# EAGLE schematic EEZ DIB MCU r1B5 (EAGLE 7.2.0)
Assembly variants: Farnell, TME

## Sheet 1 of 5: I/O connectors, Encoder, user SW
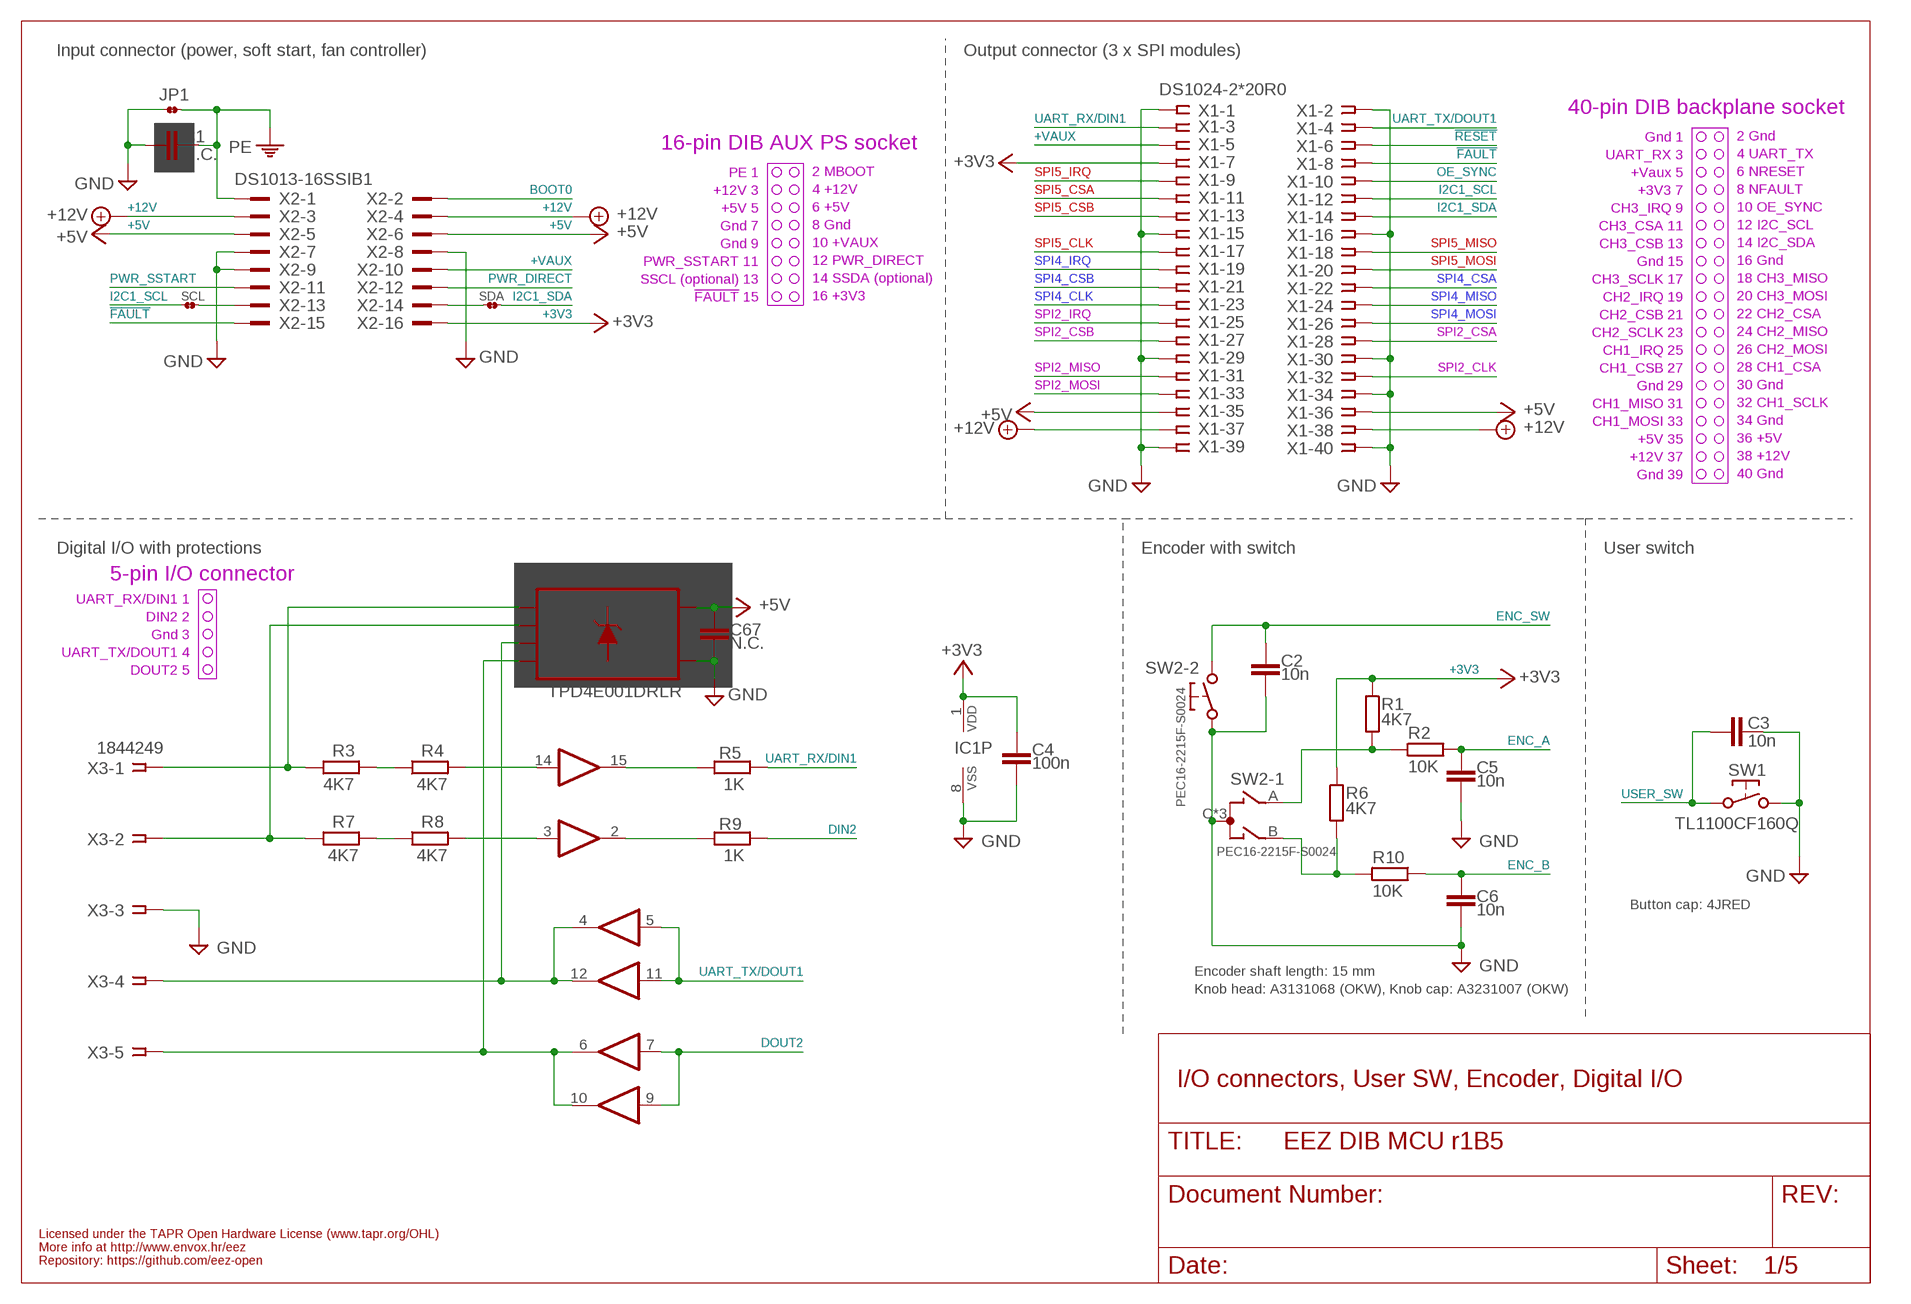
[diagram p0: schematic, sheet 1]

### Parts
C1  N.C.  C-EUC0805  [C0805]
C2  10n  C-EUC0805  [C0805]
C3  10n  C-EUC0805  [C0805]
C4  100n  C-EUC0603  [C0603]
C5  10n  C-EUC0805  [C0805]
C6  10n  C-EUC0805  [C0805]
C67  N.C.  C-EUC0603  [C0603]
IC1  CD74HC4050PWR  [PW16]
IC14  TPD4E001DRLR  TPD4E001-DRL  [DRL6]
JP1  JP2-NOCUT  [JP2-NOCUT]
R1  4K7  R-EU_R0805  [R0805]
R2  10K  R-EU_R0805  [R0805]
R3  4K7  R-EU_R0805  [R0805]
R4  4K7  R-EU_R0805  [R0805]
R5  1K  R-EU_R0805  [R0805]
R6  4K7  R-EU_R0805  [R0805]
R7  4K7  R-EU_R0805  [R0805]
R8  4K7  R-EU_R0805  [R0805]
R9  1K  R-EU_R0805  [R0805]
R10  10K  R-EU_R0805  [R0805]
SCL  JP2-NOCUT  [JP2-NOCUT]
SDA  JP2-NOCUT  [JP2-NOCUT]
SW1  TL1100CF160Q  TL1100C  [TL1100C]
SW2  PEC16-2215F-S0024  ENCODER_SW-PEC16  [PEC16-2215F]
X1  DS1024-2*20R0  ZL263-40DG  [ZL263-40DG]
X2  DS1013-16SSIB1  IDC-16PIN  [IDC-16PIN]
X3  1844249  MC1,5/5-G-3,5  [MC1,5/5-G-3,5]

### Nets
!FAULT: X1.8 X2.15 ; also sheet 2
!RESET: X1.6 ; also sheet 2,3,4,5
+3V3: C4.1 IC1.1(P:VDD) R1.1 R6.1 X1.7 X2.16 ; also sheet 2,3,4,5
+5V: C67.1 IC14.6(VCC) X1.35 X1.36 X2.5 X2.6 ; also sheet 2,4
+12V: X1.37 X1.38 X2.3 X2.4
+VAUX: X1.5 X2.10 ; also sheet 2
BOOT0: X2.2 ; also sheet 2
DIN2: R9.2 ; also sheet 2
DOUT2: IC1.7(C:I) IC1.9(D:I) ; also sheet 2
ENC_A: C5.2 R2.1 ; also sheet 2
ENC_B: C6.1 R10.1 ; also sheet 2
ENC_SW: C2.2 SW2.E ; also sheet 2
EOUT_A: R6.2 R10.2 SW2.B(-1:B)
EOUT_B: R1.2 R2.2 SW2.A(-1:A)
GND [gnd]: C1.2 C2.1 C3.1 C4.2 C5.1 C6.2 C67.2 IC1.8(P:VSS) IC14.3(GND) JP1.1 SW1.2 SW2.C(-1:C) SW2.D SW2.GND1(-1:C) SW2.GND2(-1:C) X1.1 X1.2 X1.15 X1.16 X1.29 X1.30 X1.34 X1.39 X1.40 X2.7 X2.8 X2.9 X3.3 ; also sheet 2,3,4,5
I2C1_SCL: SCL.1 X1.12 ; also sheet 2,3,4
I2C1_SDA: SDA.2 X1.14 ; also sheet 2,3,4
N$6: IC14.1(IO1) R3.1 X3.1
N$7: SCL.2 X2.13
N$13: SDA.1 X2.14
N$14: IC14.2(IO2) R7.1 X3.2
N$38: R7.2 R8.1
N$41: R3.2 R4.1
N$42: IC1.15(F:O) R5.1
N$43: IC1.2(A:O) R9.1
N$46: IC1.14(F:I) R4.2
N$47: IC1.3(A:I) R8.2
N$48: IC1.4(B:O) IC1.12(E:O) IC14.4(IO3) X3.4
N$49: IC1.6(C:O) IC1.10(D:O) IC14.5(IO4) X3.5
OE_SYNC: X1.10 ; also sheet 2
PE: C1.1 JP1.2 X2.1 ; also sheet 4,5
PWR_DIRECT: X2.12 ; also sheet 2
PWR_SSTART: X2.11 ; also sheet 2
SPI2_CLK: X1.32 ; also sheet 2
SPI2_CSA: X1.28 ; also sheet 2
SPI2_CSB: X1.27 ; also sheet 2
SPI2_IRQ: X1.25 ; also sheet 2
SPI2_MISO: X1.31 ; also sheet 2
SPI2_MOSI: X1.33 ; also sheet 2
SPI4_CLK: X1.23 ; also sheet 2
SPI4_CSA: X1.22 ; also sheet 2
SPI4_CSB: X1.21 ; also sheet 2
SPI4_IRQ: X1.19 ; also sheet 2
SPI4_MISO: X1.24 ; also sheet 2
SPI4_MOSI: X1.26 ; also sheet 2
SPI5_CLK: X1.17 ; also sheet 2
SPI5_CSA: X1.11 ; also sheet 2
SPI5_CSB: X1.13 ; also sheet 2
SPI5_IRQ: X1.9 ; also sheet 2
SPI5_MISO: X1.18 ; also sheet 2
SPI5_MOSI: X1.20 ; also sheet 2
UART_RX/DIN1: R5.2 X1.3 ; also sheet 2
UART_TX/DOUT1: IC1.5(B:I) IC1.11(E:I) X1.4 ; also sheet 2
USER_SW: C3.2 SW1.1 ; also sheet 2

### Notes on the sheet
- Input connector (power, soft start, fan controller) | Output connector (3 x SPI modules)
- 40-pin DIB backplane socket
- Gnd 1
- 2 Gnd
- 16-pin DIB AUX PS socket | UART_RX 3
- 4 UART_TX
- PE 1 | +Vaux 5
- 2 MBOOT | 6 NRESET
- +12V 3 | +3V3 7
- 4 +12V | 8 NFAULT
- +5V 5 | CH3_IRQ 9
- 6 +5V | 10 OE_SYNC
- Gnd 7 | CH3_CSA 11
- 8 Gnd | 12 I2C_SCL
- Gnd 9 | CH3_CSB 13
- 10 +VAUX | 14 I2C_SDA
- PWR_SSTART 11 | Gnd 15
- 12 PWR_DIRECT | 16 Gnd
- SSCL (optional) 13 | CH3_SCLK 17
- 14 SSDA (optional) | 18 CH3_MISO
- !FAULT! 15 | CH2_IRQ 19
- 16 +3V3 | 20 CH3_MOSI
- CH2_CSB 21
- 22 CH2_CSA
- CH2_SCLK 23
- 24 CH2_MISO
- CH1_IRQ 25
- 26 CH2_MOSI
- CH1_CSB 27
- 28 CH1_CSA
- Gnd 29
- 30 Gnd
- CH1_MISO 31
- 32 CH1_SCLK
- CH1_MOSI 33
- 34 Gnd
- +5V 35
- 36 +5V
- +12V 37
- 38 +12V
- Gnd 39
- 40 Gnd
- Digital I/O with protections | Encoder with switch | User switch
- 5-pin I/O connector
- UART_RX/DIN1 1
- DIN2 2
- Gnd 3
- UART_TX/DOUT1 4
- DOUT2 5
- Button cap: 4JRED
- Encoder shaft length: 15 mm
- Knob head: A3131068 (OKW), Knob cap: A3231007 (OKW)
- I/O connectors, User SW, Encoder, Digital I/O
- Licensed under the TAPR Open Hardware License (www.tapr.org/OHL)
- More info at http://www.envox.hr/eez
- Repository: https://github.com/eez-open

## Sheet 2 of 5: STM32F7 MCU
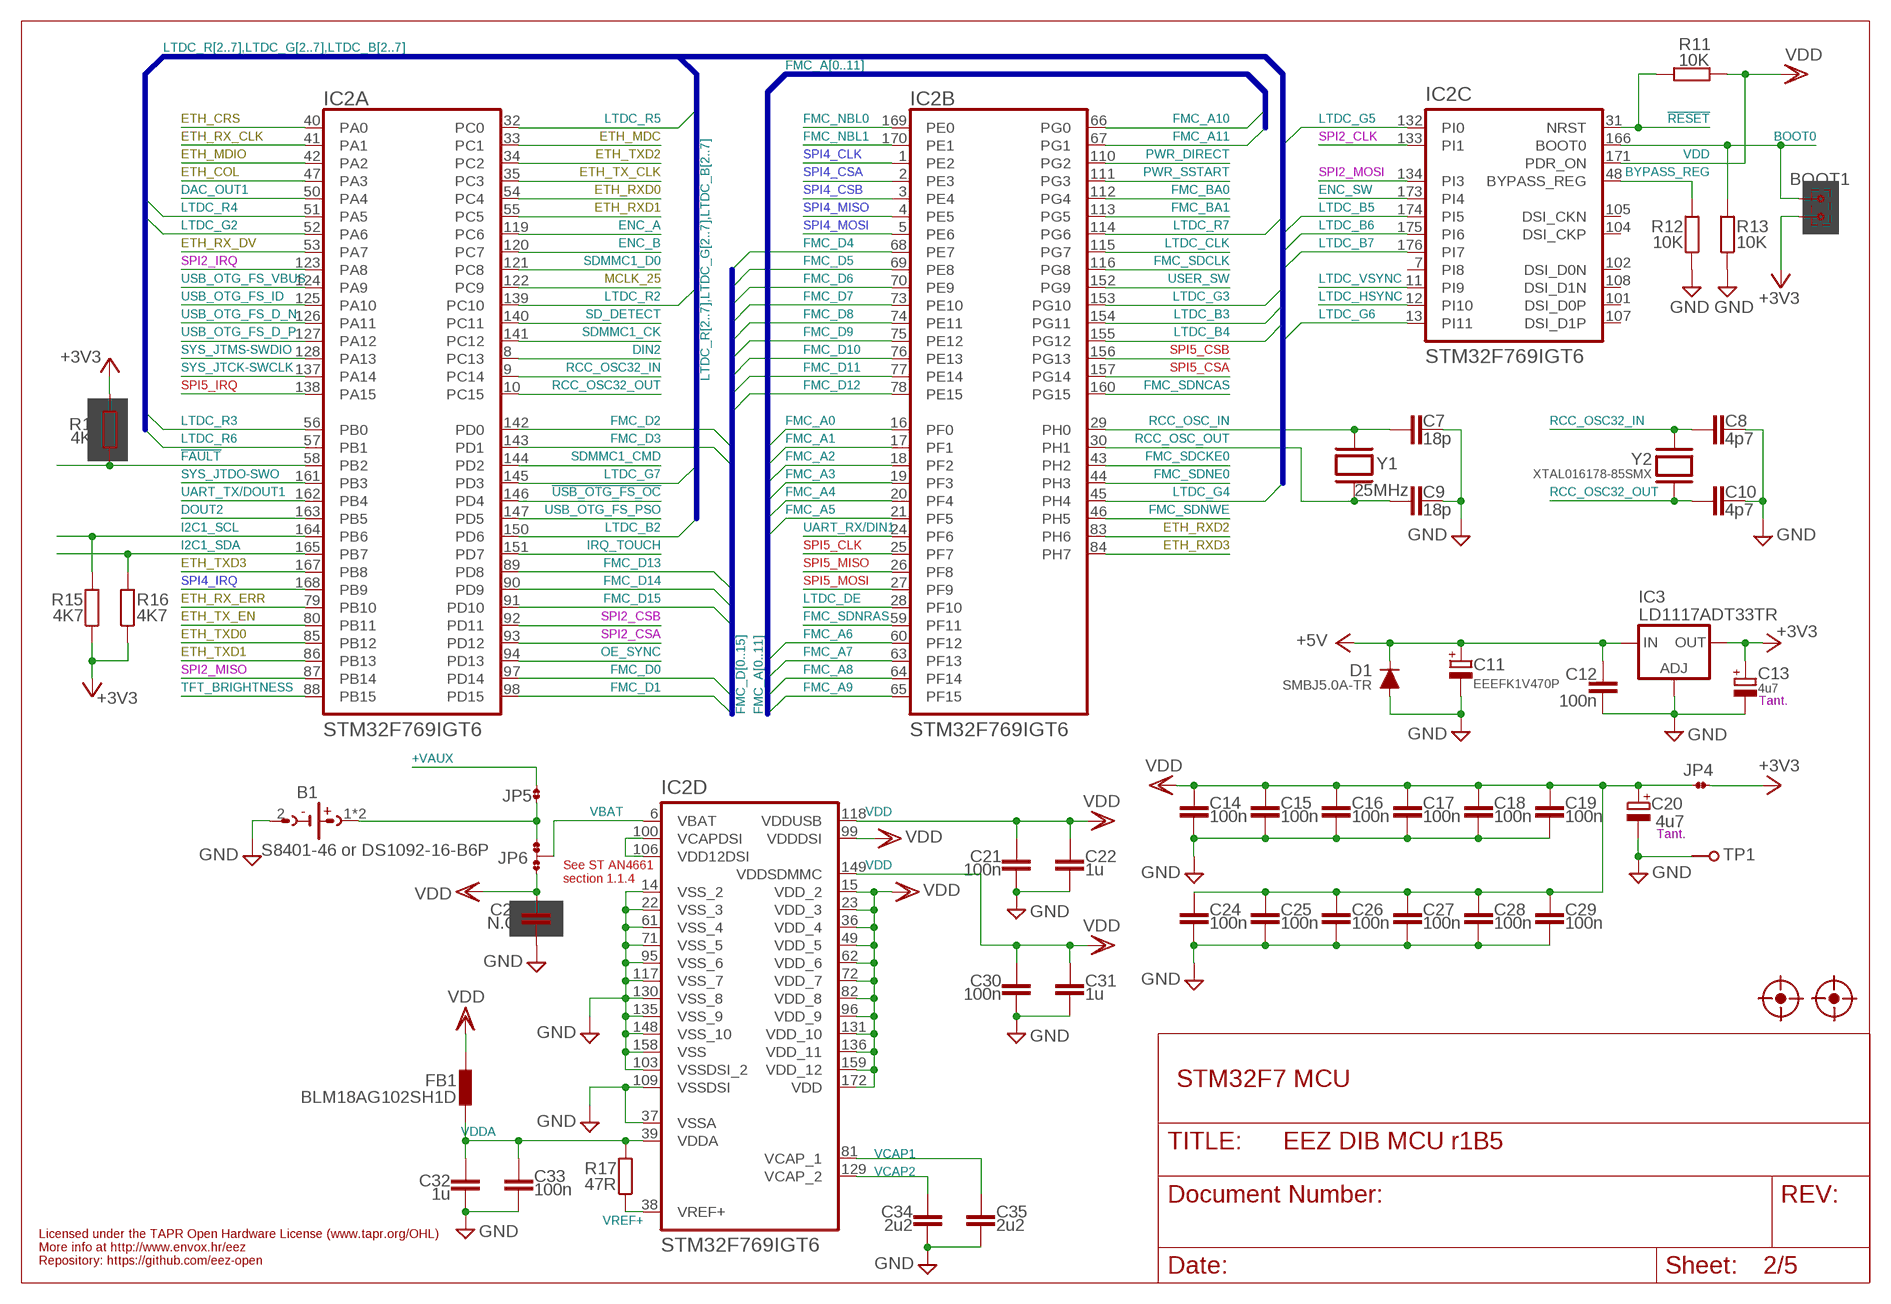
[diagram p1: schematic, sheet 2]

### Parts
B1  S8401-46 or DS1092-16-B6P  CELL_BATTERYVERT  [S8401-46]
BOOT1  JUMPER-2PIN-2MM  [2MM-2]
C7  18p  C-EUC0603  [C0603]
C8  4p7  C-EUC0603  [C0603]
C9  18p  C-EUC0603  [C0603]
C10  4p7  C-EUC0603  [C0603]
C11  EEEFK1V470P  ECAPPANASONIC_H  [CAPAE660X610N]
C12  100n  C-EUC0603  [C0603]
C13  4u7  ECAP1206  [EC1206]
C14  100n  C-EUC0603  [C0603]
C15  100n  C-EUC0603  [C0603]
C16  100n  C-EUC0603  [C0603]
C17  100n  C-EUC0603  [C0603]
C18  100n  C-EUC0603  [C0603]
C19  100n  C-EUC0603  [C0603]
C20  4u7  ECAP1206  [EC1206]
C21  100n  C-EUC0603  [C0603]
C22  1u  C-EUC0805  [C0805]
C23  N.C.  C-EUC0603  [C0603]
C24  100n  C-EUC0603  [C0603]
C25  100n  C-EUC0603  [C0603]
C26  100n  C-EUC0603  [C0603]
C27  100n  C-EUC0603  [C0603]
C28  100n  C-EUC0603  [C0603]
C29  100n  C-EUC0603  [C0603]
C30  100n  C-EUC0603  [C0603]
C31  1u  C-EUC0805  [C0805]
C32  1u  C-EUC0805  [C0805]
C33  100n  C-EUC0603  [C0603]
C34  2u2  C-EUC0805  [C0805]
C35  2u2  C-EUC0805  [C0805]
D1  SMBJ5.0A-TR  DIODEDO214AA  [DO214AA]
FB1  BLM18AG102SH1D  FERRITE_BEAD0603  [BEAD0603]
FM1  FIDUCIAL  [FIDUCIAL]
FM2  FIDUCIAL  [FIDUCIAL]
IC2  STM32F769IGT6  STM32F769IXT  [LQFP-176_24X24MM]
IC3  LD1117ADT33TR  LD117ADT33TR  [DPACK]
JP4  JP2-NOCUT  [JP2-NOCUT]
JP5  JP2-CUT  [JP2-CUT]
JP6  JP3-CUT  [JP3-CUT]
R11  10K  R-EU_R0805  [R0805]
R12  10K  R-EU_R0805  [R0805]
R13  10K  R-EU_R0805  [R0805]
R14  4K7  R-EU_R0805  [R0805]
R15  4K7  R-EU_R0805  [R0805]
R16  4K7  R-EU_R0805  [R0805]
R17  47R  R-EU_R0805  [R0805]
TP1  PCB_TEST_TABSHIELD  [PCB_SHIELD_TAB]
Y1  25MHz  XTALSMD  [HC-49/4H]
Y2  XTAL016178-85SMX  XTAL85SMX  [85SMX]

### Nets
!FAULT: IC2.58(A:PB2) R14.2 ; also sheet 1
!RESET: IC2.31(C:NRST) R11.2 ; also sheet 1,3,4,5
!USB_OTG_FS_OC: IC2.146(A:PD4) ; also sheet 4
+3V3: BOOT1.2 C13.+ IC3.4(OUT) JP4.2 R14.1 R15.1 R16.1 ; also sheet 1,3,4,5
+5V: C11.1(+) C12.1 D1.C IC3.3(IN) ; also sheet 1,4
+VAUX: JP5.2 ; also sheet 1
BOOT0: BOOT1.1 IC2.166(C:BOOT0) R13.2 ; also sheet 1
BYPASS_REG: IC2.48(C:BYPASS_REG) R12.2
DAC_OUT1: IC2.50(A:PA4) ; also sheet 4
DIN2: IC2.8(A:PC13) ; also sheet 1
DOUT2: IC2.163(A:PB5) ; also sheet 1
ENC_A: IC2.119(A:PC6) ; also sheet 1
ENC_B: IC2.120(A:PC7) ; also sheet 1
ENC_SW: IC2.173(C:PI4) ; also sheet 1
ETH_COL: IC2.47(A:PA3) ; also sheet 5
ETH_CRS: IC2.40(A:PA0) ; also sheet 5
ETH_MDC: IC2.33(A:PC1) ; also sheet 5
ETH_MDIO: IC2.42(A:PA2) ; also sheet 5
ETH_RX_CLK: IC2.41(A:PA1) ; also sheet 5
ETH_RX_DV: IC2.53(A:PA7) ; also sheet 5
ETH_RX_ERR: IC2.79(A:PB10) ; also sheet 5
ETH_RXD0: IC2.54(A:PC4) ; also sheet 5
ETH_RXD1: IC2.55(A:PC5) ; also sheet 5
ETH_RXD2: IC2.83(B:PH6) ; also sheet 5
ETH_RXD3: IC2.84(B:PH7) ; also sheet 5
ETH_TX_CLK: IC2.35(A:PC3) ; also sheet 5
ETH_TX_EN: IC2.80(A:PB11) ; also sheet 5
ETH_TXD0: IC2.85(A:PB12) ; also sheet 5
ETH_TXD1: IC2.86(A:PB13) ; also sheet 5
ETH_TXD2: IC2.34(A:PC2) ; also sheet 5
ETH_TXD3: IC2.167(A:PB8) ; also sheet 5
FMC_A0: IC2.16(B:PF0) ; also sheet 3
FMC_A1: IC2.17(B:PF1) ; also sheet 3
FMC_A2: IC2.18(B:PF2) ; also sheet 3
FMC_A3: IC2.19(B:PF3) ; also sheet 3
FMC_A4: IC2.20(B:PF4) ; also sheet 3
FMC_A5: IC2.21(B:PF5) ; also sheet 3
FMC_A6: IC2.60(B:PF12) ; also sheet 3
FMC_A7: IC2.63(B:PF13) ; also sheet 3
FMC_A8: IC2.64(B:PF14) ; also sheet 3
FMC_A9: IC2.65(B:PF15) ; also sheet 3
FMC_A10: IC2.66(B:PG0) ; also sheet 3
FMC_A11: IC2.67(B:PG1) ; also sheet 3
FMC_BA0: IC2.112(B:PG4) ; also sheet 3
FMC_BA1: IC2.113(B:PG5) ; also sheet 3
FMC_D0: IC2.97(A:PD14) ; also sheet 3
FMC_D1: IC2.98(A:PD15) ; also sheet 3
FMC_D2: IC2.142(A:PD0) ; also sheet 3
FMC_D3: IC2.143(A:PD1) ; also sheet 3
FMC_D4: IC2.68(B:PE7) ; also sheet 3
FMC_D5: IC2.69(B:PE8) ; also sheet 3
FMC_D6: IC2.70(B:PE9) ; also sheet 3
FMC_D7: IC2.73(B:PE10) ; also sheet 3
FMC_D8: IC2.74(B:PE11) ; also sheet 3
FMC_D9: IC2.75(B:PE12) ; also sheet 3
FMC_D10: IC2.76(B:PE13) ; also sheet 3
FMC_D11: IC2.77(B:PE14) ; also sheet 3
FMC_D12: IC2.78(B:PE15) ; also sheet 3
FMC_D13: IC2.89(A:PD8) ; also sheet 3
FMC_D14: IC2.90(A:PD9) ; also sheet 3
FMC_D15: IC2.91(A:PD10) ; also sheet 3
FMC_NBL0: IC2.169(B:PE0) ; also sheet 3
FMC_NBL1: IC2.170(B:PE1) ; also sheet 3
FMC_SDCKE0: IC2.43(B:PH2) ; also sheet 3
FMC_SDCLK: IC2.116(B:PG8) ; also sheet 3
FMC_SDNCAS: IC2.160(B:PG15) ; also sheet 3
FMC_SDNE0: IC2.44(B:PH3) ; also sheet 3
FMC_SDNRAS: IC2.59(B:PF11) ; also sheet 3
FMC_SDNWE: IC2.46(B:PH5) ; also sheet 3
GND [gnd]: B1.2(-) C7.1 C8.2 C9.1 C10.2 C11.2(-) C12.2 C13.- C14.2 C15.2 C16.2 C17.2 C18.2 C19.2 C20.- C21.2 C22.2 C23.2 C24.2 C25.2 C26.2 C27.2 C28.2 C29.2 C30.2 C31.2 C32.2 C33.2 C34.2 C35.2 D1.A IC2.14(D:VSS_2) IC2.22(D:VSS_3) IC2.37(D:VSSA) IC2.61(D:VSS_4) IC2.71(D:VSS_5) IC2.95(D:VSS_6) IC2.103(D:VSSDSI_2) IC2.109(D:VSSDSI) IC2.117(D:VSS_7) IC2.130(D:VSS_8) IC2.135(D:VSS_9) IC2.148(D:VSS_10) IC2.158(D:VSS) IC3.1(ADJ) R12.1 R13.1 TP1.1 ; also sheet 1,3,4,5
I2C1_SCL: IC2.164(A:PB6) R15.2 ; also sheet 1,3,4
I2C1_SDA: IC2.165(A:PB7) R16.2 ; also sheet 1,3,4
IRQ_TOUCH: IC2.151(A:PD7) ; also sheet 4
LTDC_B2: IC2.150(A:PD6) ; also sheet 4
LTDC_B3: IC2.154(B:PG11) ; also sheet 4
LTDC_B4: IC2.155(B:PG12) ; also sheet 4
LTDC_B5: IC2.174(C:PI5) ; also sheet 4
LTDC_B6: IC2.175(C:PI6) ; also sheet 4
LTDC_B7: IC2.176(C:PI7) ; also sheet 4
LTDC_CLK: IC2.115(B:PG7) ; also sheet 4
LTDC_DE: IC2.28(B:PF10) ; also sheet 4
LTDC_G2: IC2.52(A:PA6) ; also sheet 4
LTDC_G3: IC2.153(B:PG10) ; also sheet 4
LTDC_G4: IC2.45(B:PH4) ; also sheet 4
LTDC_G5: IC2.132(C:PI0) ; also sheet 4
LTDC_G6: IC2.13(C:PI11) ; also sheet 4
LTDC_G7: IC2.145(A:PD3) ; also sheet 4
LTDC_HSYNC: IC2.12(C:PI10) ; also sheet 4
LTDC_R2: IC2.139(A:PC10) ; also sheet 4
LTDC_R3: IC2.56(A:PB0) ; also sheet 4
LTDC_R4: IC2.51(A:PA5) ; also sheet 4
LTDC_R5: IC2.32(A:PC0) ; also sheet 4
LTDC_R6: IC2.57(A:PB1) ; also sheet 4
LTDC_R7: IC2.114(B:PG6) ; also sheet 4
LTDC_VSYNC: IC2.11(C:PI9) ; also sheet 4
MCLK_25: IC2.122(A:PC9) ; also sheet 5
N$20: B1.1(+) B1.3(+) JP5.1 JP6.NC
N$178: IC2.100(D:VCAPDSI) IC2.106(D:VDD12DSI)
OE_SYNC: IC2.94(A:PD13) ; also sheet 1
PWR_DIRECT: IC2.110(B:PG2) ; also sheet 1
PWR_SSTART: IC2.111(B:PG3) ; also sheet 1
RCC_OSC32_IN: C8.1 IC2.9(A:PC14) Y2.1
RCC_OSC32_OUT: C10.1 IC2.10(A:PC15) Y2.4
RCC_OSC_IN: C7.2 IC2.29(B:PH0) Y1.2
RCC_OSC_OUT: C9.2 IC2.30(B:PH1) Y1.1
SD_DETECT: IC2.140(A:PC11) ; also sheet 3
SDMMC1_CK: IC2.141(A:PC12) ; also sheet 3
SDMMC1_CMD: IC2.144(A:PD2) ; also sheet 3
SDMMC1_D0: IC2.121(A:PC8) ; also sheet 3
SPI2_CLK: IC2.133(C:PI1) ; also sheet 1
SPI2_CSA: IC2.93(A:PD12) ; also sheet 1
SPI2_CSB: IC2.92(A:PD11) ; also sheet 1
SPI2_IRQ: IC2.123(A:PA8) ; also sheet 1
SPI2_MISO: IC2.87(A:PB14) ; also sheet 1
SPI2_MOSI: IC2.134(C:PI3) ; also sheet 1
SPI4_CLK: IC2.1(B:PE2) ; also sheet 1
SPI4_CSA: IC2.2(B:PE3) ; also sheet 1
SPI4_CSB: IC2.3(B:PE4) ; also sheet 1
SPI4_IRQ: IC2.168(A:PB9) ; also sheet 1
SPI4_MISO: IC2.4(B:PE5) ; also sheet 1
SPI4_MOSI: IC2.5(B:PE6) ; also sheet 1
SPI5_CLK: IC2.25(B:PF7) ; also sheet 1
SPI5_CSA: IC2.157(B:PG14) ; also sheet 1
SPI5_CSB: IC2.156(B:PG13) ; also sheet 1
SPI5_IRQ: IC2.138(A:PA15) ; also sheet 1
SPI5_MISO: IC2.26(B:PF8) ; also sheet 1
SPI5_MOSI: IC2.27(B:PF9) ; also sheet 1
SYS_JTCK-SWCLK: IC2.137(A:PA14) ; also sheet 3
SYS_JTDO-SWO: IC2.161(A:PB3) ; also sheet 3
SYS_JTMS-SWDIO: IC2.128(A:PA13) ; also sheet 3
TFT_BRIGHTNESS: IC2.88(A:PB15) ; also sheet 4
UART_RX/DIN1: IC2.24(B:PF6) ; also sheet 1
UART_TX/DOUT1: IC2.162(A:PB4) ; also sheet 1
USB_OTG_FS_D_N [diff]: IC2.126(A:PA11) ; also sheet 4
USB_OTG_FS_D_P [diff]: IC2.127(A:PA12) ; also sheet 4
USB_OTG_FS_ID: IC2.125(A:PA10) ; also sheet 4
USB_OTG_FS_PSO: IC2.147(A:PD5) ; also sheet 4
USB_OTG_FS_VBUS: IC2.124(A:PA9) ; also sheet 4
USER_SW: IC2.152(B:PG9) ; also sheet 1
VBAT: IC2.6(D:VBAT) JP6.COM
VCAP1: C35.1 IC2.81(D:VCAP_1)
VCAP2: C34.1 IC2.129(D:VCAP_2)
VDD: C14.1 C15.1 C16.1 C17.1 C18.1 C19.1 C20.+ C21.1 C22.1 C23.1 C24.1 C25.1 C26.1 C27.1 C28.1 C29.1 C30.1 C31.1 FB1.P$1 IC2.15(D:VDD_2) IC2.23(D:VDD_3) IC2.36(D:VDD_4) IC2.49(D:VDD_5) IC2.62(D:VDD_6) IC2.72(D:VDD_7) IC2.82(D:VDD_8) IC2.96(D:VDD_9) IC2.99(D:VDDDSI) IC2.118(D:VDDUSB) IC2.131(D:VDD_10) IC2.136(D:VDD_11) IC2.149(D:VDDSDMMC) IC2.159(D:VDD_12) IC2.171(C:PDR_ON) IC2.172(D:VDD) JP4.1 JP6.NO R11.1
VDDA: C32.1 C33.1 FB1.P$2 IC2.39(D:VDDA) R17.2
VREF+: IC2.38(D:VREF+) R17.1
Unconnected: IC2.7(C:PI8) IC2.101(C:DSI_D0P) IC2.102(C:DSI_D0N) IC2.104(C:DSI_CKP) IC2.105(C:DSI_CKN) IC2.107(C:DSI_D1P) IC2.108(C:DSI_D1N)

### Buses
FMC_A[0..11]
LTDC_R[2..7],LTDC_G[2..7],LTDC_B[2..7]
FMC_D[0..15]

### Notes on the sheet
- Tant.
- Tant.
- See ST AN4661
  section 1.1.4
- STM32F7 MCU
- Licensed under the TAPR Open Hardware License (www.tapr.org/OHL)
- More info at http://www.envox.hr/eez
- Repository: https://github.com/eez-open

## Sheet 3 of 5: SDRAM, JTAG, SD card, EEPROM
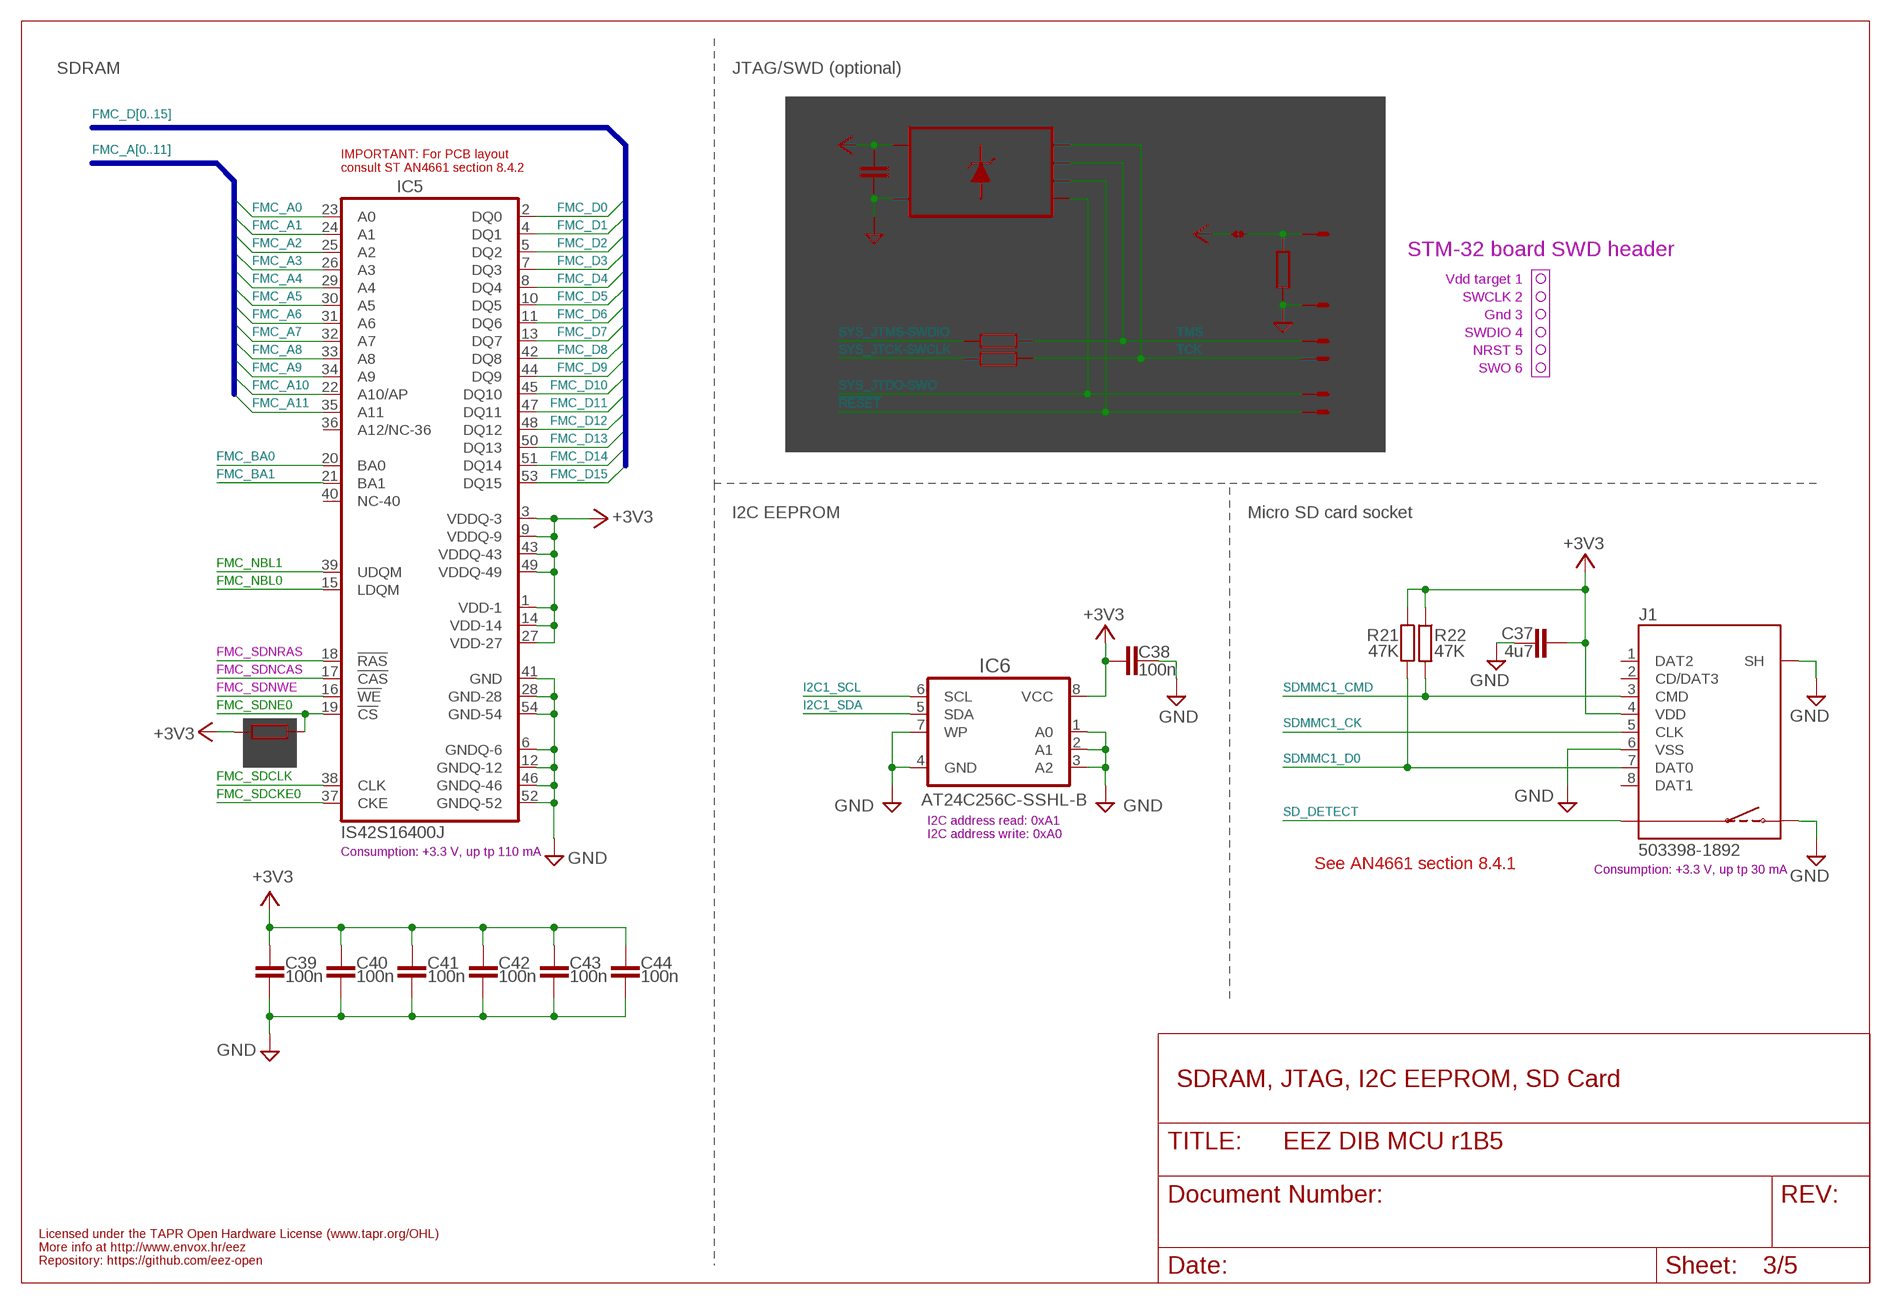
[diagram p2: schematic, sheet 3]

### Parts
C36  N.C.  C-EUC0603  [C0603]
C37  4u7  C-EUC1206  [C1206]
C38  100n  C-EUC0603  [C0603]
C39  100n  C-EUC0603  [C0603]
C40  100n  C-EUC0603  [C0603]
C41  100n  C-EUC0603  [C0603]
C42  100n  C-EUC0603  [C0603]
C43  100n  C-EUC0603  [C0603]
C44  100n  C-EUC0603  [C0603]
IC4  TPD4E001DRLR  TPD4E001-DRL  [DRL6]
IC5  IS42S16400J  IS42S16400  [TSOPII-54]
IC6  AT24C256C-SSHL-B  AT24CXXSOIC8  [SOIC127P600X173-8N]
J1  503398-1892  5033981892  [5033981892]
JP7  JP2-CUT  [JP2-CUT]
R18  N.C.  R-EU_R0805  [R0805]
R19  N.C.  R-EU_R0805  [R0805]
R20  N.C.  R-EU_R0805  [R0805]
R21  47K  R-EU_R0805  [R0805]
R22  47K  R-EU_R0805  [R0805]
R23  N.C.  R-EU_R0805  [R0805]
X4  N.C.  22-23-2061  [22-23-2061]

### Nets
!RESET: IC4.4(IO3) X4.5 ; also sheet 1,2,4,5
+3V3: C36.1 C37.1 C38.2 C39.1 C40.1 C41.1 C42.1 C43.1 C44.1 IC4.6(VCC) IC5.1(VDD-1) IC5.3(VDDQ-3) IC5.9(VDDQ-9) IC5.14(VDD-14) IC5.27(VDD-27) IC5.43(VDDQ-43) IC5.49(VDDQ-49) IC6.8(VCC) J1.4(VDD) JP7.1 R21.1 R22.1 R23.1 ; also sheet 1,2,4,5
FMC_A0: IC5.23(A0) ; also sheet 2
FMC_A1: IC5.24(A1) ; also sheet 2
FMC_A2: IC5.25(A2) ; also sheet 2
FMC_A3: IC5.26(A3) ; also sheet 2
FMC_A4: IC5.29(A4) ; also sheet 2
FMC_A5: IC5.30(A5) ; also sheet 2
FMC_A6: IC5.31(A6) ; also sheet 2
FMC_A7: IC5.32(A7) ; also sheet 2
FMC_A8: IC5.33(A8) ; also sheet 2
FMC_A9: IC5.34(A9) ; also sheet 2
FMC_A10: IC5.22(A10/AP) ; also sheet 2
FMC_A11: IC5.35(A11) ; also sheet 2
FMC_BA0: IC5.20(BA0) ; also sheet 2
FMC_BA1: IC5.21(BA1) ; also sheet 2
FMC_D0: IC5.2(DQ0) ; also sheet 2
FMC_D1: IC5.4(DQ1) ; also sheet 2
FMC_D2: IC5.5(DQ2) ; also sheet 2
FMC_D3: IC5.7(DQ3) ; also sheet 2
FMC_D4: IC5.8(DQ4) ; also sheet 2
FMC_D5: IC5.10(DQ5) ; also sheet 2
FMC_D6: IC5.11(DQ6) ; also sheet 2
FMC_D7: IC5.13(DQ7) ; also sheet 2
FMC_D8: IC5.42(DQ8) ; also sheet 2
FMC_D9: IC5.44(DQ9) ; also sheet 2
FMC_D10: IC5.45(DQ10) ; also sheet 2
FMC_D11: IC5.47(DQ11) ; also sheet 2
FMC_D12: IC5.48(DQ12) ; also sheet 2
FMC_D13: IC5.50(DQ13) ; also sheet 2
FMC_D14: IC5.51(DQ14) ; also sheet 2
FMC_D15: IC5.53(DQ15) ; also sheet 2
FMC_NBL0: IC5.15(LDQM) ; also sheet 2
FMC_NBL1: IC5.39(UDQM) ; also sheet 2
FMC_SDCKE0: IC5.37(CKE) ; also sheet 2
FMC_SDCLK: IC5.38(CLK) ; also sheet 2
FMC_SDNCAS: IC5.17(!CAS) ; also sheet 2
FMC_SDNE0: IC5.19(!CS) R23.2 ; also sheet 2
FMC_SDNRAS: IC5.18(!RAS) ; also sheet 2
FMC_SDNWE: IC5.16(!WE) ; also sheet 2
GND [gnd]: C36.2 C37.2 C38.1 C39.2 C40.2 C41.2 C42.2 C43.2 C44.2 IC4.3(GND) IC5.6(GNDQ-6) IC5.12(GNDQ-12) IC5.28(GND-28) IC5.41(GND) IC5.46(GNDQ-46) IC5.52(GNDQ-52) IC5.54(GND-54) IC6.1(A0) IC6.2(A1) IC6.3(A2) IC6.4(GND) IC6.7(WP) J1.6(VSS) J1.S1(SH) J1.S2(SH) J1.S(SH) J1.SW2 R18.1 X4.3 ; also sheet 1,2,4,5
I2C1_SCL: IC6.6(SCL) ; also sheet 1,2,4
I2C1_SDA: IC6.5(SDA) ; also sheet 1,2,4
N$51: JP7.2 R18.2 X4.1
SD_DETECT: J1.SW1 ; also sheet 2
SDMMC1_CK: J1.5(CLK) ; also sheet 2
SDMMC1_CMD: J1.3(CMD) R22.2 ; also sheet 2
SDMMC1_D0: J1.7(DAT0) R21.2 ; also sheet 2
SYS_JTCK-SWCLK: R20.1 ; also sheet 2
SYS_JTDO-SWO: IC4.5(IO4) X4.6 ; also sheet 2
SYS_JTMS-SWDIO: R19.1 ; also sheet 2
TCK: IC4.1(IO1) R20.2 X4.2
TMS: IC4.2(IO2) R19.2 X4.4
Unconnected: IC5.36(A12/NC-36) IC5.40(NC-40) J1.1(DAT2) J1.2(CD/DAT3) J1.8(DAT1)

### Buses
FMC_A[0..11]
FMC_D[0..15]

### Notes on the sheet
- SDRAM | JTAG/SWD (optional)
- IMPORTANT: For PCB layout 
  consult ST AN4661 section 8.4.2
- STM-32 board SWD header
- Vdd target 1
- SWCLK 2
- Gnd 3
- SWDIO 4
- NRST 5
- SWO 6
- I2C EEPROM | Micro SD card socket
- I2C address read: 0xA1
- I2C address write: 0xA0
- Consumption: +3.3 V, up tp 110 mA
- See AN4661 section 8.4.1
- Consumption: +3.3 V, up tp 30 mA
- SDRAM, JTAG, I2C EEPROM, SD Card
- Licensed under the TAPR Open Hardware License (www.tapr.org/OHL)
- More info at http://www.envox.hr/eez
- Repository: https://github.com/eez-open

## Sheet 4 of 5: TFT LCD, Audio, USB
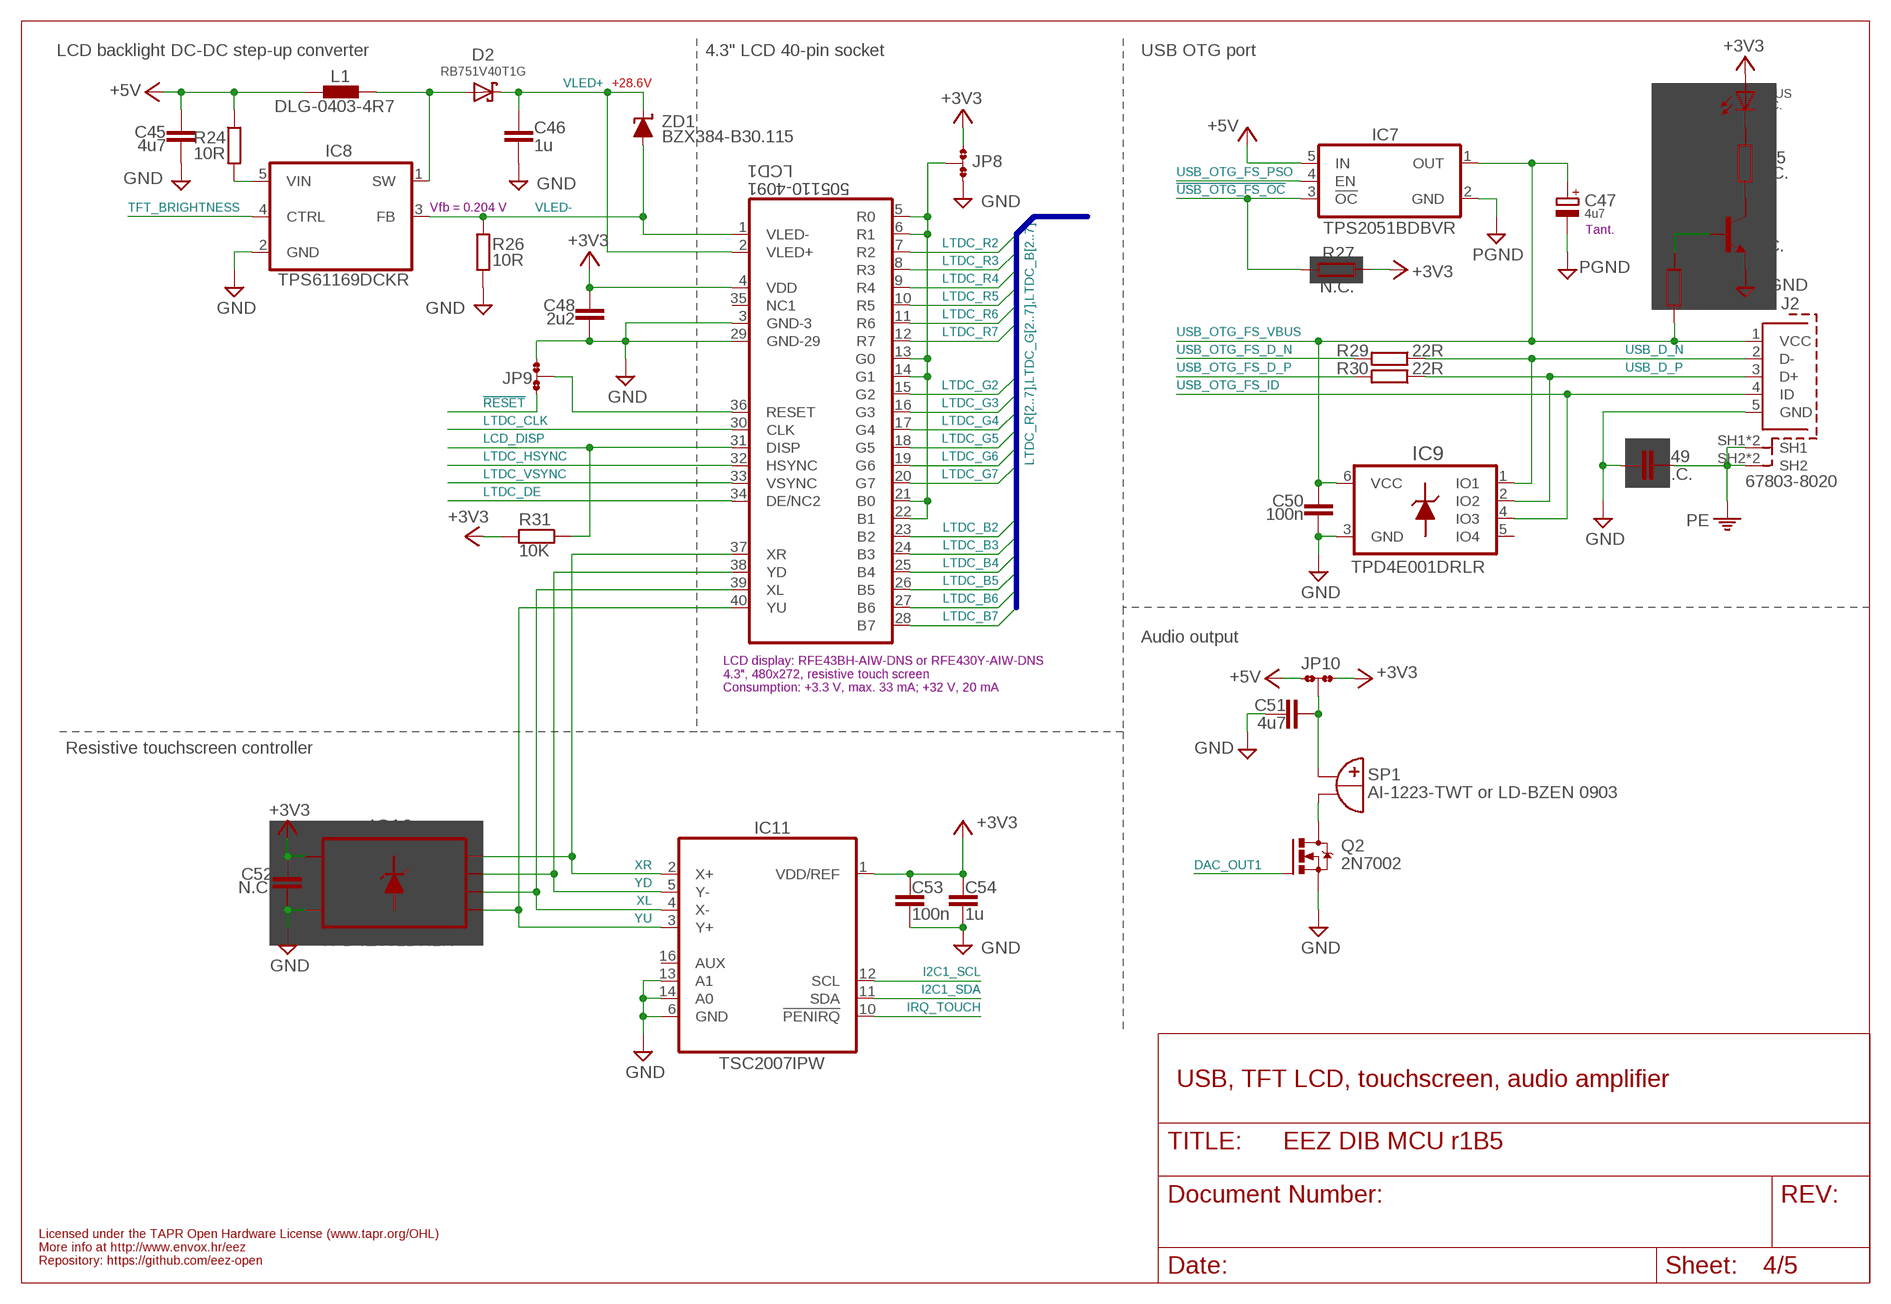
[diagram p3: schematic, sheet 4]

### Parts
C45  4u7  C-EUC1206  [C1206]
C46  1u  C-EUC0805  [C0805]
C47  4u7  ECAP1206  [EC1206]
C48  2u2  C-EUC0805  [C0805]
C49  N.C.  C-EUC0805  [C0805]
C50  100n  C-EUC0603  [C0603]
C51  4u7  C-EUC1206  [C1206]
C52  N.C.  C-EUC0603  [C0603]
C53  100n  C-EUC0603  [C0603]
C54  1u  C-EUC0805  [C0805]
D2  RB751V40T1G  SCHOTTKYSOD-323R  [SOD323-R]
IC7  TPS2051BDBVR  TPS2051B  [DBV5]
IC8  TPS61169DCKR  [DCK5]
IC9  TPD4E001DRLR  TPD4E001-DRL  [DRL6]
IC10  TPD4E001DRLR  TPD4E001-DRL  [DRL6]
IC11  TSC2007IPW  [PW(R-PDSO-G16)]
J2  67803-8020  678038020  [678038020]
JP8  JP3-CUT  [JP3-CUT]
JP9  JP3-CUT  [JP3-CUT]
JP10  JP3-CUT  [JP3-CUT]
L1  DLG-0403-4R7  DE0403  [DE0403]
LCD1  505110-4091  RFE430Y-AIW-DNS  [FPC_40]
Q1  N.C.  MMBT5551LT1-NPN-SOT23-BEC  [SOT23-BEC]
Q2  2N7002  [SOT103P240X110-3N]
R24  10R  R-EU_R0805  [R0805]
R25  N.C.  R-EU_R0805  [R0805]
R26  10R  R-EU_R0805  [R0805]
R27  N.C.  R-EU_R0805  [R0805]
R28  N.C.  R-EU_R0805  [R0805]
R29  22R  R-EU_R0805  [R0805]
R30  22R  R-EU_R0805  [R0805]
R31  10K  R-EU_R0805  [R0805]
SP1  AI-1223-TWT or LD-BZEN 0903  AI-1223-TWT-LDB0903  [AI-1223-TWT_COMBO]
VBUS  N.C.  LED0805  [LED_0805]
ZD1  BZX384-B30.115  ZENER-DIODESOD323  [SOD323-W]

### Nets
!RESET: JP9.NO ; also sheet 1,2,3,5
!USB_OTG_FS_OC: IC7.3(!OC) R27.1 ; also sheet 2
+3V3: C48.1 C52.2 C53.2 C54.2 IC10.6(VCC) IC11.1(VDD/REF) JP8.NO JP10.NC LCD1.4(VDD) R27.2 R31.2 VBUS.A ; also sheet 1,2,3,5
+5V: C45.1 IC7.5(IN) JP10.NO L1.1 R24.1 ; also sheet 1,2
DAC_OUT1: Q2.1(G) ; also sheet 2
GND [gnd]: C45.2 C46.2 C47.- C48.2 C49.2 C50.1 C51.1 C52.1 C53.1 C54.1 IC7.2(GND) IC8.2(GND) IC9.3(GND) IC10.3(GND) IC11.6(GND) IC11.13(A1) IC11.14(A0) J2.5(GND) JP8.NC JP9.NC LCD1.3(GND-3) LCD1.29(GND-29) Q1.E Q2.2(S) R26.2 ; supply symbol labelled PGND ; also sheet 1,2,3,5
I2C1_SCL: IC11.12(SCL) ; also sheet 1,2,3
I2C1_SDA: IC11.11(SDA) ; also sheet 1,2,3
IRQ_TOUCH: IC11.10(!PENIRQ) ; also sheet 2
LCD_DISP: LCD1.31(DISP) R31.1
LTDC_B2: LCD1.23(B2) ; also sheet 2
LTDC_B3: LCD1.24(B3) ; also sheet 2
LTDC_B4: LCD1.25(B4) ; also sheet 2
LTDC_B5: LCD1.26(B5) ; also sheet 2
LTDC_B6: LCD1.27(B6) ; also sheet 2
LTDC_B7: LCD1.28(B7) ; also sheet 2
LTDC_CLK: LCD1.30(CLK) ; also sheet 2
LTDC_DE: LCD1.34(DE/NC2) ; also sheet 2
LTDC_G2: LCD1.15(G2) ; also sheet 2
LTDC_G3: LCD1.16(G3) ; also sheet 2
LTDC_G4: LCD1.17(G4) ; also sheet 2
LTDC_G5: LCD1.18(G5) ; also sheet 2
LTDC_G6: LCD1.19(G6) ; also sheet 2
LTDC_G7: LCD1.20(G7) ; also sheet 2
LTDC_HSYNC: LCD1.32(HSYNC) ; also sheet 2
LTDC_R2: LCD1.7(R2) ; also sheet 2
LTDC_R3: LCD1.8(R3) ; also sheet 2
LTDC_R4: LCD1.9(R4) ; also sheet 2
LTDC_R5: LCD1.10(R5) ; also sheet 2
LTDC_R6: LCD1.11(R6) ; also sheet 2
LTDC_R7: LCD1.12(R7) ; also sheet 2
LTDC_VSYNC: LCD1.33(VSYNC) ; also sheet 2
N$2: R25.2 VBUS.C
N$4 [gnd]: JP8.COM LCD1.5(R0) LCD1.6(R1) LCD1.13(G0) LCD1.14(G1) LCD1.21(B0) LCD1.22(B1)
N$5: Q2.3(D) SP1.-B(-) SP1.-B.1(-)
N$16: Q1.C R25.1
N$19: Q1.B R28.2
N$24: JP9.COM LCD1.36(RESET)
N$30: IC8.5(VIN) R24.2
N$52: C51.2 JP10.COM SP1.+B(+) SP1.+B.1(+)
PE: C49.1 J2.SH1 J2.SH1.1(SH1) J2.SH2 J2.SH2.2(SH2) ; also sheet 1,5
SW_WLED: D2.A IC8.1(SW) L1.2
TFT_BRIGHTNESS: IC8.4(CTRL) ; also sheet 2
USB_D_N [diff]: IC9.1(IO1) J2.2(D-) R29.1
USB_D_P [diff]: IC9.2(IO2) J2.3(D+) R30.1
USB_OTG_FS_D_N [diff]: R29.2 ; also sheet 2
USB_OTG_FS_D_P [diff]: R30.2 ; also sheet 2
USB_OTG_FS_ID: IC9.4(IO3) J2.4(ID) ; also sheet 2
USB_OTG_FS_PSO: IC7.4(EN) ; also sheet 2
USB_OTG_FS_VBUS: C47.+ C50.2 IC7.1(OUT) IC9.6(VCC) J2.1(VCC) R28.1 ; also sheet 2
VLED+: C46.1 D2.C LCD1.2(VLED+) ZD1.C
VLED-: IC8.3(FB) LCD1.1(VLED-) R26.1 ZD1.A
XL: IC10.4(IO3) IC11.4(X-) LCD1.39(XL)
XR: IC10.1(IO1) IC11.2(X+) LCD1.37(XR)
YD: IC10.2(IO2) IC11.5(Y-) LCD1.38(YD)
YU: IC10.5(IO4) IC11.3(Y+) LCD1.40(YU)
Unconnected: IC9.5(IO4) IC11.16(AUX) LCD1.35(NC1)

### Buses
LTDC_R[2..7],LTDC_G[2..7],LTDC_B[2..7]

### Notes on the sheet
- LCD backlight DC-DC step-up converter | 4.3" LCD 40-pin socket | USB OTG port
- +28.6V
- Vfb = 0.204 V
- Tant.
- Audio output
- LCD display: RFE43BH-AIW-DNS or RFE430Y-AIW-DNS
  4.3", 480x272, resistive touch screen
- Consumption: +3.3 V, max. 33 mA; +32 V, 20 mA
- Resistive touchscreen controller
- USB, TFT LCD, touchscreen, audio amplifier
- Licensed under the TAPR Open Hardware License (www.tapr.org/OHL)
- More info at http://www.envox.hr/eez
- Repository: https://github.com/eez-open

## Sheet 5 of 5: Ethernet PHY
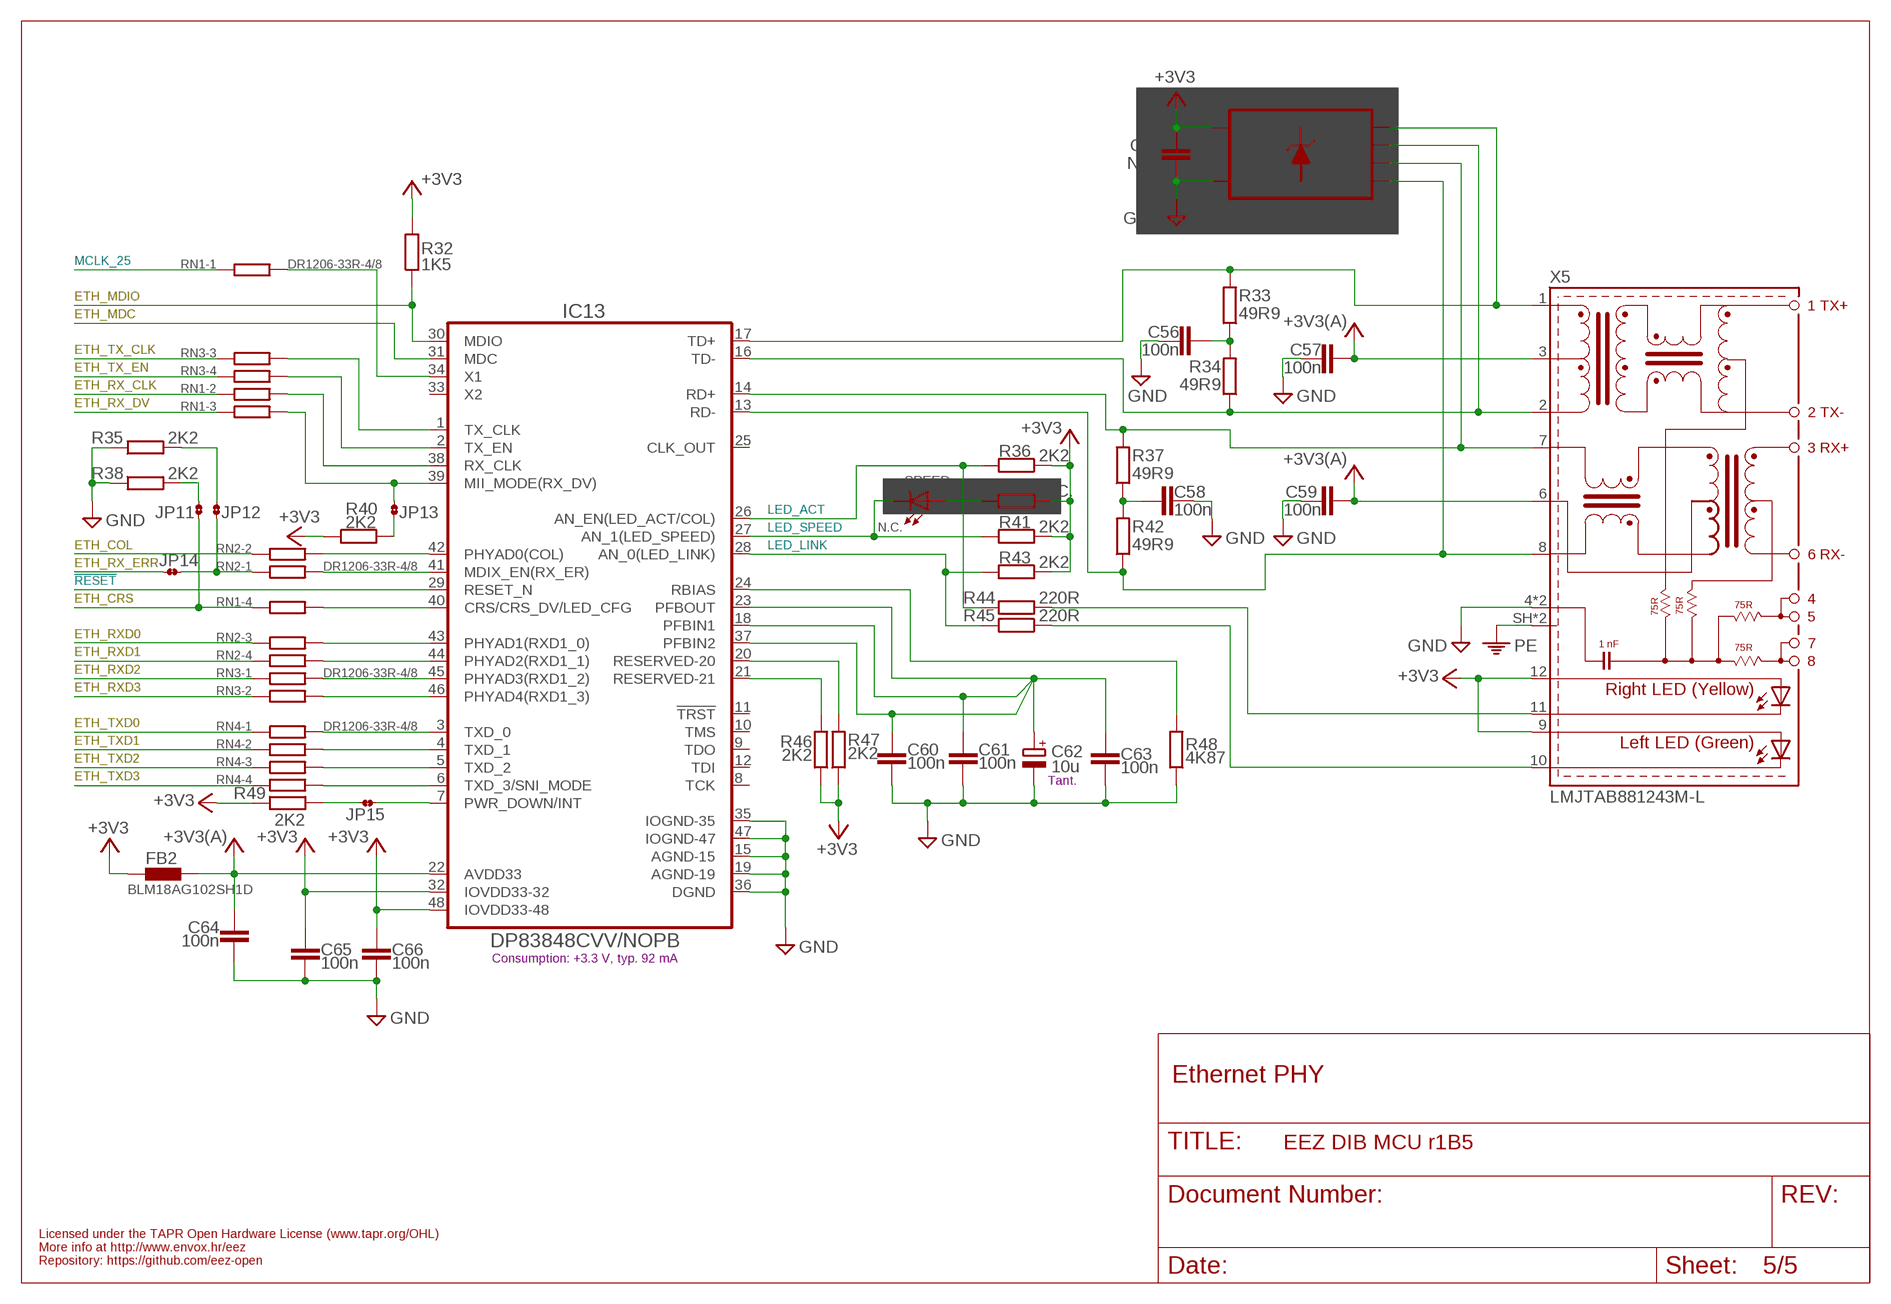
[diagram p4: schematic, sheet 5]

### Parts
C55  N.C.  C-EUC0603  [C0603]
C56  100n  C-EUC0603  [C0603]
C57  100n  C-EUC0603  [C0603]
C58  100n  C-EUC0603  [C0603]
C59  100n  C-EUC0603  [C0603]
C60  100n  C-EUC0603  [C0603]
C61  100n  C-EUC0603  [C0603]
C62  10u  ECAP1206  [EC1206]
C63  100n  C-EUC0603  [C0603]
C64  100n  C-EUC0603  [C0603]
C65  100n  C-EUC0603  [C0603]
C66  100n  C-EUC0603  [C0603]
FB2  BLM18AG102SH1D  FERRITE_BEAD0603  [BEAD0603]
IC12  TPD4E001DRLR  TPD4E001-DRL  [DRL6]
IC13  DP83848CVV/NOPB  [PT48]
JP11  JP2-CUT  [JP2-CUT]
JP12  JP2-CUT  [JP2-CUT]
JP13  JP2-CUT  [JP2-CUT]
JP14  JP2-NOCUT  [JP2-NOCUT]
JP15  JP2-NOCUT  [JP2-NOCUT]
R32  1K5  R-EU_R0805  [R0805]
R33  49R9  R-EU_R0805  [R0805]
R34  49R9  R-EU_R0805  [R0805]
R35  2K2  R-EU_R0805  [R0805]
R36  2K2  R-EU_R0805  [R0805]
R37  49R9  R-EU_R0805  [R0805]
R38  2K2  R-EU_R0805  [R0805]
R39  N.C.  R-EU_R0805  [R0805]
R40  2K2  R-EU_R0805  [R0805]
R41  2K2  R-EU_R0805  [R0805]
R42  49R9  R-EU_R0805  [R0805]
R43  2K2  R-EU_R0805  [R0805]
R44  220R  R-EU_R0805  [R0805]
R45  220R  R-EU_R0805  [R0805]
R46  2K2  R-EU_R0805  [R0805]
R47  2K2  R-EU_R0805  [R0805]
R48  4K87  R-EU_R0805  [R0805]
R49  2K2  R-EU_R0805  [R0805]
RN1  DR1206-33R-4/8  R_ARRAY4  [CAY16]
RN2  DR1206-33R-4/8  R_ARRAY4  [CAY16]
RN3  DR1206-33R-4/8  R_ARRAY4  [CAY16]
RN4  DR1206-33R-4/8  R_ARRAY4  [CAY16]
SPEED  N.C.  LED0805  [LED_0805]
X5  LMJTAB881243M-L  RJ45-TRAFO-LED  [RJ45-TRAFO-LED]

### Nets
!RESET: IC13.29(RESET_N) ; also sheet 1,2,3,4
+3V3: C55.1 C65.1 C66.1 FB2.P$1 IC12.6(VCC) IC13.32(IOVDD33-32) IC13.48(IOVDD33-48) R32.2 R36.1 R39.1 R40.1 R41.1 R43.1 R46.1 R47.1 R49.1 X5.9(GREEN-A) X5.12(YELLOW_A) ; also sheet 1,2,3,4
+3V3(A): C57.2 C59.2 C64.1 FB2.P$2 IC13.22(AVDD33) X5.3(CT) X5.6(CR)
ETH_COL: RN2.2 ; also sheet 2
ETH_CRS: JP11.1 RN1.4 ; also sheet 2
ETH_MDC: IC13.31(MDC) ; also sheet 2
ETH_MDIO: IC13.30(MDIO) R32.1 ; also sheet 2
ETH_RX_CLK: RN1.2 ; also sheet 2
ETH_RX_DV: RN1.3 ; also sheet 2
ETH_RX_ER: JP12.1 JP14.1 RN2.1
ETH_RX_ERR: JP14.2 ; also sheet 2
ETH_RXD0: RN2.3 ; also sheet 2
ETH_RXD1: RN2.4 ; also sheet 2
ETH_RXD2: RN3.1 ; also sheet 2
ETH_RXD3: RN3.2 ; also sheet 2
ETH_TX_CLK: RN3.3 ; also sheet 2
ETH_TX_EN: RN3.4 ; also sheet 2
ETH_TXD0: RN4.1 ; also sheet 2
ETH_TXD1: RN4.2 ; also sheet 2
ETH_TXD2: RN4.3 ; also sheet 2
ETH_TXD3: RN4.4 ; also sheet 2
GND [gnd]: C55.2 C56.2 C57.1 C58.2 C59.1 C60.2 C61.2 C62.- C63.2 C64.2 C65.2 C66.2 IC12.3(GND) IC13.15(AGND-15) IC13.19(AGND-19) IC13.35(IOGND-35) IC13.36(DGND) IC13.47(IOGND-47) R35.1 R38.1 R48.1 X5.4(GND) X5.5(GND) ; also sheet 1,2,3,4
LED_ACT: IC13.26(AN_EN(LED_ACT/COL)) R36.2 R44.2
LED_LINK: IC13.28(AN_0(LED_LINK)) R43.2 R45.2
LED_SPEED: IC13.27(AN_1(LED_SPEED)) R41.2 SPEED.C
MCLK_25: RN1.1 ; also sheet 2
N$1: IC13.1(TX_CLK) RN3.6
N$3: C56.1 R33.1 R34.2
N$8: R44.1 X5.11(YELLOW-C)
N$9: R45.1 X5.10(GREEN-C)
N$10: IC13.2(TX_EN) RN3.5
N$11: IC13.39(MII_MODE(RX_DV)) JP13.2 RN1.6
N$12: IC13.38(RX_CLK) RN1.7
N$15: IC13.3(TXD_0) RN4.8
N$17: IC13.4(TXD_1) RN4.7
N$21: IC13.5(TXD_2) RN4.6
N$22: IC13.34(X1) RN1.8
N$23: JP13.1 R40.2
N$25: JP11.2 R38.2
N$26: JP12.2 R35.2
N$27: IC13.7(PWR_DOWN/INT) JP15.2
N$28: JP15.1 R49.2
N$29: IC13.6(TXD_3/SNI_MODE) RN4.5
N$31: IC13.46(PHYAD4(RXD1_3)) RN3.7
N$32: IC13.45(PHYAD3(RXD1_2)) RN3.8
N$33: IC13.42(PHYAD0(COL)) RN2.7
N$34: IC13.44(PHYAD2(RXD1_1)) RN2.5
N$35: IC13.43(PHYAD1(RXD1_0)) RN2.6
N$36: IC13.41(MDIX_EN(RX_ER)) RN2.8
N$37: IC13.40(CRS/CRS_DV/LED_CFG) RN1.5
N$97: IC13.24(RBIAS) R48.2
N$98: IC13.21(RESERVED-21) R46.2
N$99: IC13.20(RESERVED-20) R47.2
N$101: R39.2 SPEED.A
N$102: C58.1 R37.1 R42.2
PE: X5.SH X5.SH2(SH) ; also sheet 1,4
PFBOUT: C60.1 C61.1 C62.+ C63.1 IC13.18(PFBIN1) IC13.23(PFBOUT) IC13.37(PFBIN2)
RD+: IC12.4(IO3) IC13.14(RD+) R37.2 X5.7(RD+)
RD-: IC12.5(IO4) IC13.13(RD-) R42.1 X5.8(RD-)
TD+: IC12.1(IO1) IC13.17(TD+) R33.2 X5.1(TD+)
TD-: IC12.2(IO2) IC13.16(TD-) R34.1 X5.2(TD-)
Unconnected: IC13.8(TCK) IC13.9(TDO) IC13.10(TMS) IC13.11(!TRST) IC13.12(TDI) IC13.25(CLK_OUT) IC13.33(X2)

### Notes on the sheet
- Tant.
- Consumption: +3.3 V, typ. 92 mA
- Ethernet PHY
- Licensed under the TAPR Open Hardware License (www.tapr.org/OHL)
- More info at http://www.envox.hr/eez
- Repository: https://github.com/eez-open

## Library data of the parts
B1 = EEZ_Lib1:CELL_BATTERY: HARWIN Battery holder for coin cell 20mm Farnell: 2115304
BOOT1 = EEZ_Lib1:JUMPER-2PIN
C1-C10 C12 C14-C19 C21-C46 C48-C61 C63-C67 = rcl:C-EU: CAPACITOR, European symbol
C11 C13 C20 C47 C62 = EEZ_Lib1:ECAP
D1 = MyLib6:DIODE
D2 = EEZ_Lib1:SCHOTTKY
FB1 FB2 = EEZ_Lib1:FERRITE_BEAD: FAIR-RITE - 2506033007Y3 - FERRITE BEAD, 0.04OHM, 3A, 0603 Farnell: 2112873
FM1 FM2 = EEZ_Lib1:FIDUCIAL: Fiducial mark for pick and place automation
IC1 = EEZ_DIB:CD74HC4050: High-Speed CMOS Logic Hex Buffers, Non-Inverting; MANUFACTURER_PART_NUMBER: CD74HC4050PWR; VENDOR: Vendor
IC2 = EEZ_DIB:STM32F769IXT; COPYRIGHT: Copyright C 2016 Accelerated Designs. All rights reserved; MANUFACTURER_PART_NUMBER: stm32f769ixt; VENDOR: STMicroelectronics
IC3 = v-reg:LD117A?*: Low drop fixed and adjustable positive voltage regulators 1 A Source: http://www.st.com/stonline/products/literature/ds/7194/ld1117axx.pdf
IC4 IC9 IC10 IC12 IC14 = EEZ_Lib1:TPD4E001: Low-Capacitance 4-Channel ESD-Protection for High-Speed Data Interfaces
IC5 = EEZ_Lib1:IS42S16400: 1 MBits x 16 Bits x 4 Banks (64-Mbit) Synchronous Dynamic RAM
IC6 = EEZ_Lib1:AT24CXX: I2C-Compatible (2-wire) Serial EEPROM
IC7 = EEZ_Lib1:TPS2051B: Current-Limited, Power-Distribution Switch (pos. enable input)
IC8 = EEZ_Lib1:TPS61169DCKR: 38-V High Current-Boost WLED Driver with PWM Control; MANUFACTURER: Texas Instruments; PARTNUMBER: TPS61169DCKR; REFDES: RefDes; TYPE: TYPE; VALUE: Value
IC11 = EEZ_Lib1:TSC2007: 12-Bit, Nanopower, 4-Wire Micro TOUCH SCREEN CONTROLLER with I2C Interface
IC13 = EEZ_Lib1:DP83848: DP83848C/I/VYB/YB PHYTER™ QFP Single Port 10/100 Mb/s Ethernet Physical Layer Transceiver
J1 = EEZ_Lib1:5033981892: SD Micro connector; push-push; SMT; gold plated
J2 = EEZ_Lib1:678038020: USB AB mini socket; SMT; PIN:5; horizontal; gold plated
JP1 JP4 JP14 JP15 SCL SDA = EEZ_Lib1:JP2-NOCUT
JP5 JP7 JP11-JP13 = EEZ_Lib1:JP2-CUT
JP6 JP8-JP10 = EEZ_Lib1:JP3-CUT
L1 = EEZ_Lib1:DE0403: Ferrocore SMD power coil 4.0 x 4.5 mm
LCD1 = EEZ_Lib1:RFE430Y-AIW-DNS: 40-pin socket for TFT LCD display with touchscreen
Q1 = transistor:*-NPN-: NPN Transistror BF959 corrected 2008.03.06
Q2 = EEZ_Lib1:2N7002: N-CHANNEL ENHANCEMENT MODE FIELD EFFECT TRANSISTOR; MPN: 2N7002-7-F; OC_FARNELL: 1713823; OC_NEWARK: 25R5679; PACKAGE: SOT-23-3; SUPPLIER: DIODES INC.
R1-R49 = rcl:R-EU_: RESISTOR, European symbol
RN1-RN4 = EEZ_Lib1:R_ARRAY4: 1206 four resistor array
SP1 = EEZ_Lib1:AI-1223-TWT: Audio indicator 12mm
SPEED VBUS = EEZ_Lib1:LED
SW1 = EEZ_switches:TL1100C: Tactile Switch 12 X 6.45MM Right angle
SW2 = EEZ_switches:ENCODER_SW
TP1 = EEZ_Lib1:PCB_TEST_TAB
X1 = EEZ_connectors:ZL263-40DG: Socket; pin strips; female; PIN:40; angled 90°; 2.54mm; THT; 2x20
X2 = EEZ_connectors:IDC-16PIN: 16-pin IDC socket
X3 = EEZ_connectors:MC1,5/5-G-3,5: Pluggable Terminal Blocks 5-pin 3.5mm pitch Through Hole Header
X4 = EEZ_connectors:22-23-2061: .100" (2.54mm) Center Header - 6 Pin; MF: MOLEX; MPN: 22-23-2061; OC_FARNELL: 1462922; OC_NEWARK: 27C1933
X5 = EEZ_Lib1:RJ45-TRAFO-LED: AMPHENOL LMJTAB881243M-L Socket; RJ45; PIN:8; shielded, with LED and trafo; TME: LMJTAB881243M-L
Y1 Y2 = EEZ_Lib1:XTAL
ZD1 = EEZ_Lib1:ZENER-DIODE

## Net classes
0 default: width 0.152 mm, drill 0.3 mm, clearance 0.203 mm
1 diff: width 0.229 mm, drill 0.3 mm, clearance 0.203 mm
2 gnd: width 0.152 mm, drill 0.3 mm, clearance 0.203 mm